# EAGLE design WeatherLightCoord (EAGLE 9.4.0)
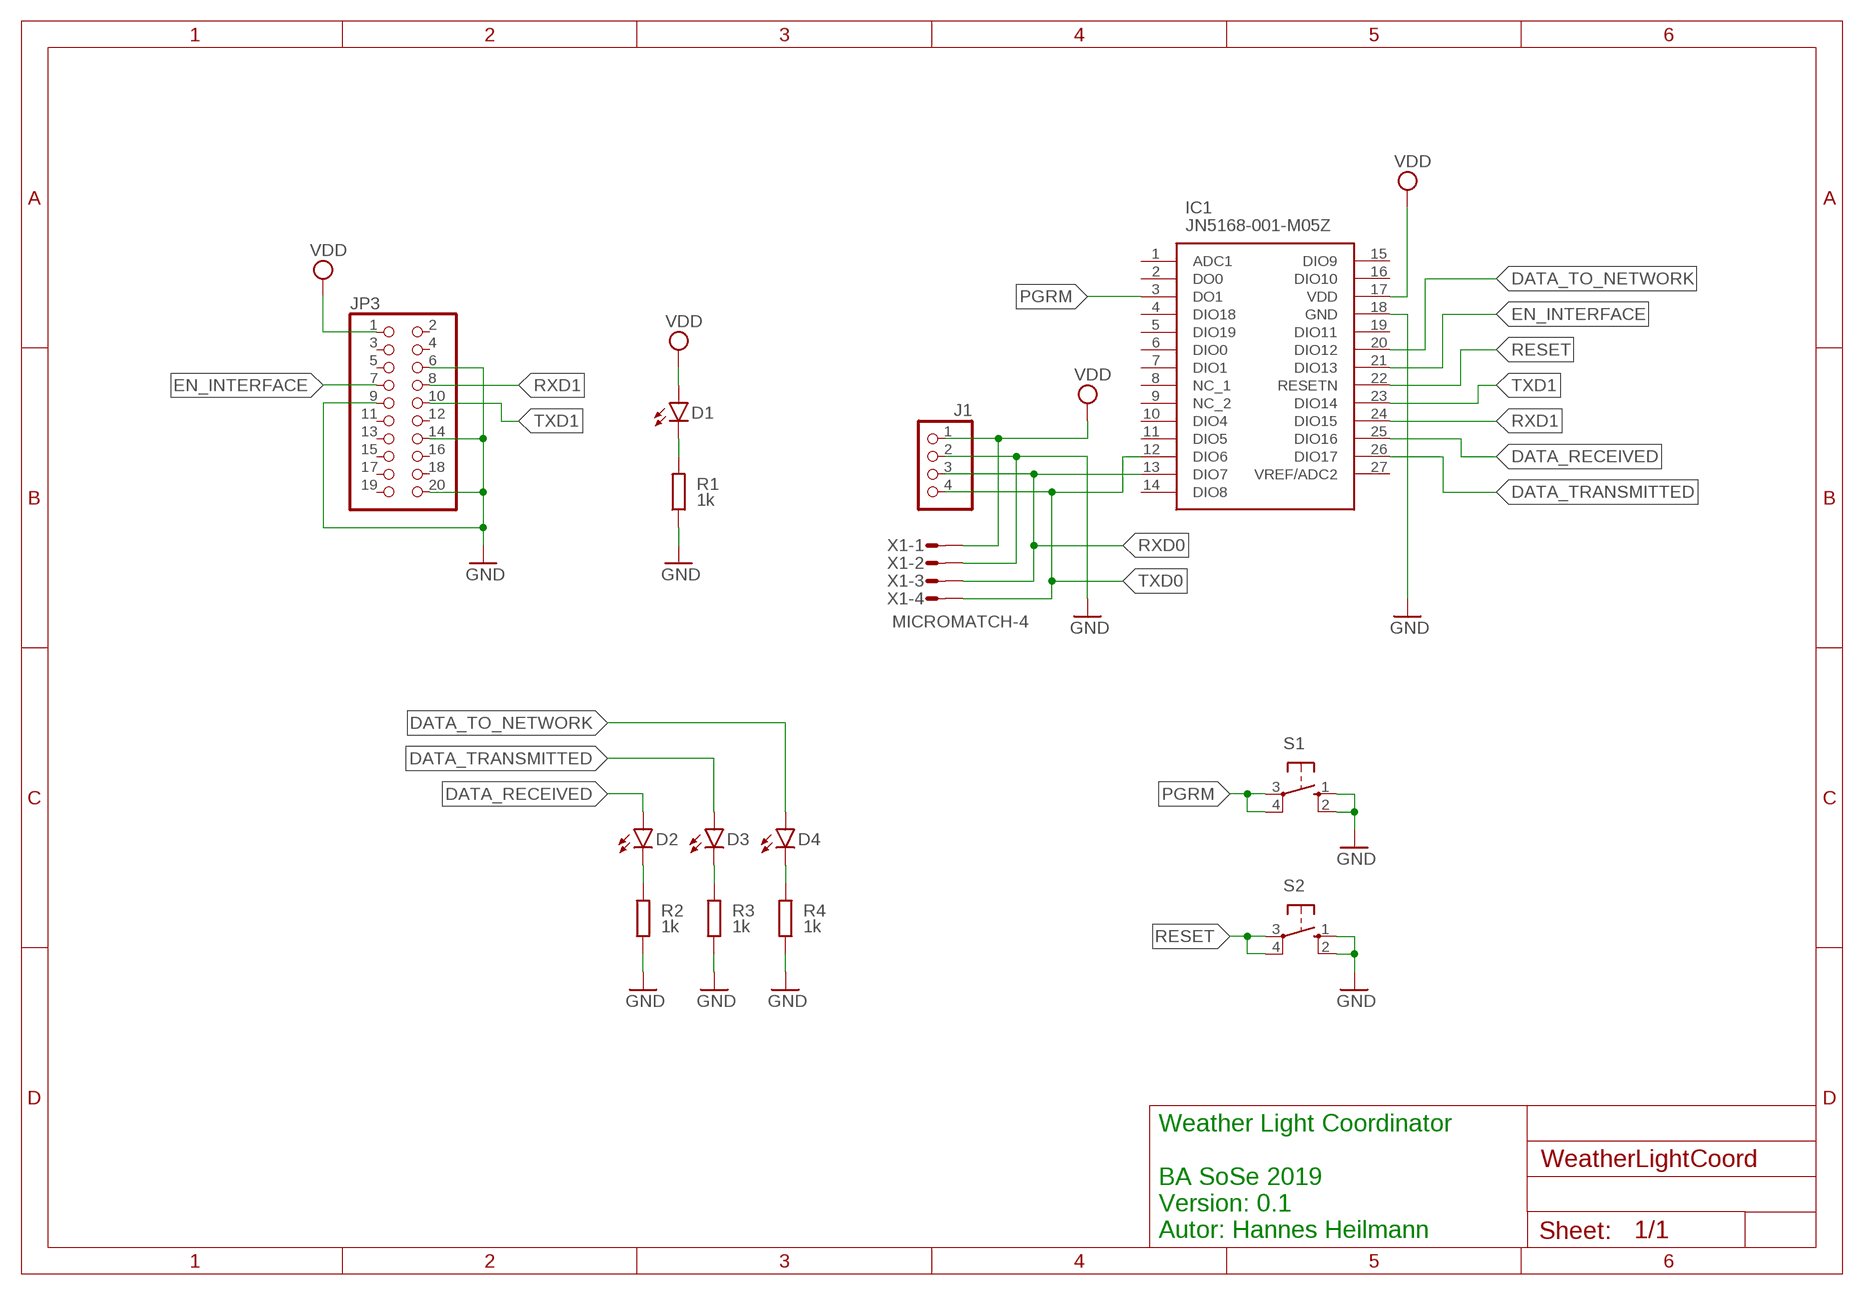
[diagram p0: schematic, sheet 1]

## Parts
D1  LEDCHIPLED_1206  [CHIPLED_1206]
D2  LEDCHIPLED_1206  [CHIPLED_1206]
D3  LEDCHIPLED_1206  [CHIPLED_1206]
D4  LEDCHIPLED_1206  [CHIPLED_1206]
IC1  JN5168-001-M05Z  [JN5168001M05Z]
J1  PINHD-1X4  [1X04]
JP3  PINHD-2X10  [2X10]
R1  1k  R-EU_R1206  [R1206]
R2  1k  R-EU_R1206  [R1206]
R3  1k  R-EU_R1206  [R1206]
R4  1k  R-EU_R1206  [R1206]
S1  10-XX  [B3F-10XX]
S2  10-XX  [B3F-10XX]
X1  MICROMATCH-4  [MICROMATCH-4]

## Nets
DATA_RECEIVED: D2.A IC1.25(DIO16)
DATA_TO_NETWORK: D4.A IC1.20(DIO12)
DATA_TRANSMITTED: D3.A IC1.26(DIO17)
EN_INTERFACE: IC1.21(DIO13) JP3.7
GND: IC1.18(GND) J1.2 JP3.6 JP3.9 JP3.14 JP3.20 R1.1 R2.1 R3.1 R4.1 S1.1(S) S1.2(S1) S2.1(S) S2.2(S1) X1.2
N$3: D1.C R1.2
N$4: D4.C R4.2
N$9: D3.C R3.2
N$10: D2.C R2.2
PGRM: IC1.3(DO1) S1.3(P) S1.4(P1)
RESET: IC1.22(RESETN) S2.3(P) S2.4(P1)
RXD0: IC1.13(DIO7) J1.3 X1.3
RXD1: IC1.24(DIO15) JP3.8
TXD0: IC1.12(DIO6) J1.4 X1.4
TXD1: IC1.23(DIO14) JP3.10
VDD: D1.A IC1.17(VDD) J1.1 JP3.1 X1.1
Unconnected: IC1.1(ADC1) IC1.2(DO0) IC1.4(DIO18) IC1.5(DIO19) IC1.6(DIO0) IC1.7(DIO1) IC1.8(NC_1) IC1.9(NC_2) IC1.10(DIO4) IC1.11(DIO5) IC1.14(DIO8) IC1.15(DIO9) IC1.16(DIO10) IC1.19(DIO11) IC1.27(VREF/ADC2) JP3.2 JP3.3 JP3.4 JP3.5 JP3.11 JP3.12 JP3.13 JP3.15 JP3.16 JP3.17 JP3.18 JP3.19

## Notes on the sheet
- Weather Light Coordinator
  
  BA SoSe 2019
  Version: 0.1
  Autor: Hannes Heilmann

## Library data of the parts
D1-D4 = led:LED: LED OSRAM: - CHIPLED LG R971, LG N971, LY N971, LG Q971, LY Q971, LO R971, LY R971 LH N974, LH R974 LS Q976, LO Q976, LY Q976 LO Q996 - Hyper CHIPLED LW Q18S LB Q993, LB Q99A, LB R99A - SideLED LS A670, LO A670, LY A670, LG A670, LP A670 LB A673, LV A673, LT A673, LW A673 LH A674 LY A675 LS A676, LA A676, LO A676, LY A676, LW A676 LS A679, LY A679, LG A679 - Hyper Micro SIDELED® LS Y876, LA Y876, LO Y876, LY Y876 LT Y87S - SmartLED LW L88C, LW L88S LB L89C, LB L89S, LG L890 LS L89K, LO L89K, LY L89K LS L896, LA L896, LO L896, LY L896 - TOPLED LS T670, LO T670, LY T670, LG T670, LP T670 LSG T670, LSP T670, LSY T670, LOP T670, LYG T670 LG T671, LOG T671, LSG T671 LB T673, LV T673, LT T673, LW T673 LH T674 LS T676, LA T676, LO T676, LY T676, LB T676, LH T676, LSB T676, LW T676 LB T67C, LV T67C, LT T67C, LS T67K, LO T67K, LY T67K, LW E67C LS E67B, LA E67B, LO E67B, LY E67B, LB E67C, LV E67C, LT E67C LW T67C LS T679, LY T679, LG T679 LS T770, LO T770, LY T770, LG T770, LP T770 LB T773, LV T773, LT T773, LW T773 LH T774 LS E675, LA E675, LY E675, LS T675 LS T776, LA T776, LO T776, LY T776, LB T776 LHGB T686 LT T68C, LB T68C - Hyper Mini TOPLED® LB M676 - Mini TOPLED Santana® LG M470 LS M47K, LO M47K, LY M47K Source: http://www.osram.convergy.de LUXEON: - LUMILED® LXK2-PW12-R00, LXK2-PW12-S00, LXK2-PW14-U00, LXK2-PW14-V00 LXK2-PM12-R00, LXK2-PM12-S00, LXK2-PM14-U00 LXK2-PE12-Q00, LXK2-PE12-R00, LXK2-PE12-S00, LXK2-PE14-T00, LXK2-PE14-U00 LXK2-PB12-K00, LXK2-PB12-L00, LXK2-PB12-M00, LXK2-PB14-N00, LXK2-PB14-P00, LXK2-PB14-Q00 LXK2-PR12-L00, LXK2-PR12-M00, LXK2-PR14-Q00, LXK2-PR14-R00 LXK2-PD12-Q00, LXK2-PD12-R00, LXK2-PD12-S00 LXK2-PH12-R00, LXK2-PH12-S00 LXK2-PL12-P00, LXK2-PL12-Q00, LXK2-PL12-R00 Source: www.luxeon.com KINGBRIGHT: KA-3528ASYC Source: www.kingbright.com
IC1 = SamacSys_Parts:JN5168-001-M05Z: NXP - JN5168-001-M05Z - RF MOD, IEEE802.15.4, MED PWR, UFL CONN Source: Datasheet <https://www.nxp.com/docs/en/data-sheet/JN5168-001-MXX.pdf>; DESCRIPTION: NXP - JN5168-001-M05Z - RF MOD, IEEE802.15.4, MED PWR, UFL CONN; HEIGHT: 5mm; MANUFACTURER_NAME: Nexperia; MANUFACTURER_PART_NUMBER: JN5168-001-M05Z; MOUSER_PART_NUMBER: 771-JN5168-001-M05Z; MOUSER_PRICE-STOCK: https://www.mouser.com/Search/Refine.aspx?Keyword=771-JN5168-001-M05Z
J1 = pinhead:PINHD-1X4: PIN HEADER
JP3 = pinhead:PINHD-2X10: PIN HEADER
R1-R4 = rcl:R-EU_: RESISTOR, European symbol; SPICEPREFIX: R
S1 S2 = switch-omron:10-XX: OMRON SWITCH; MPN: B3F-1000; OC_FARNELL: 176432; OC_NEWARK: 36M3542
X1 = con-amp-micromatch:MICROMATCH-4: MicroMaTch 4 7-215464-4 / 0-215464-4 Drawing Number C-215464 DDEController.pdf; MPN: 7-215464-4; OC_FARNELL: 3784629; OC_NEWARK: 19R8124

## Board
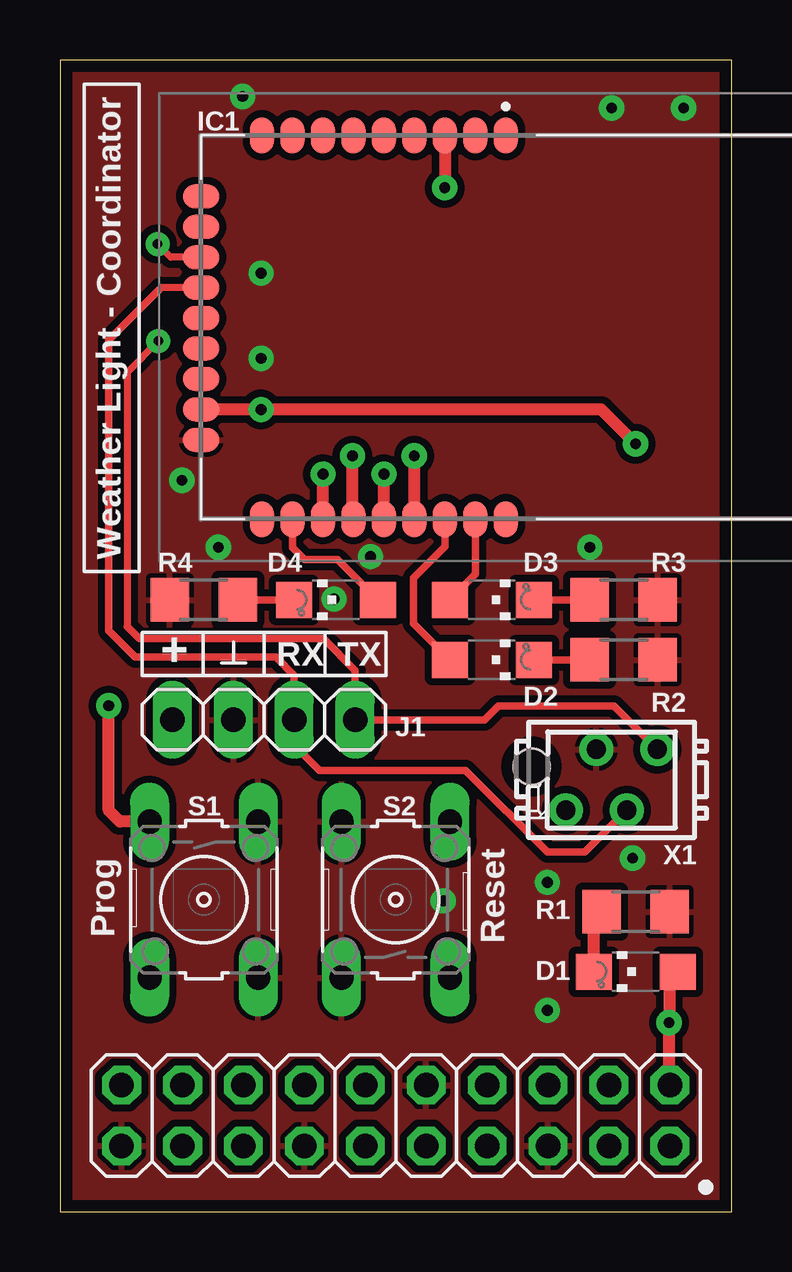
[diagram p1: board, top side]
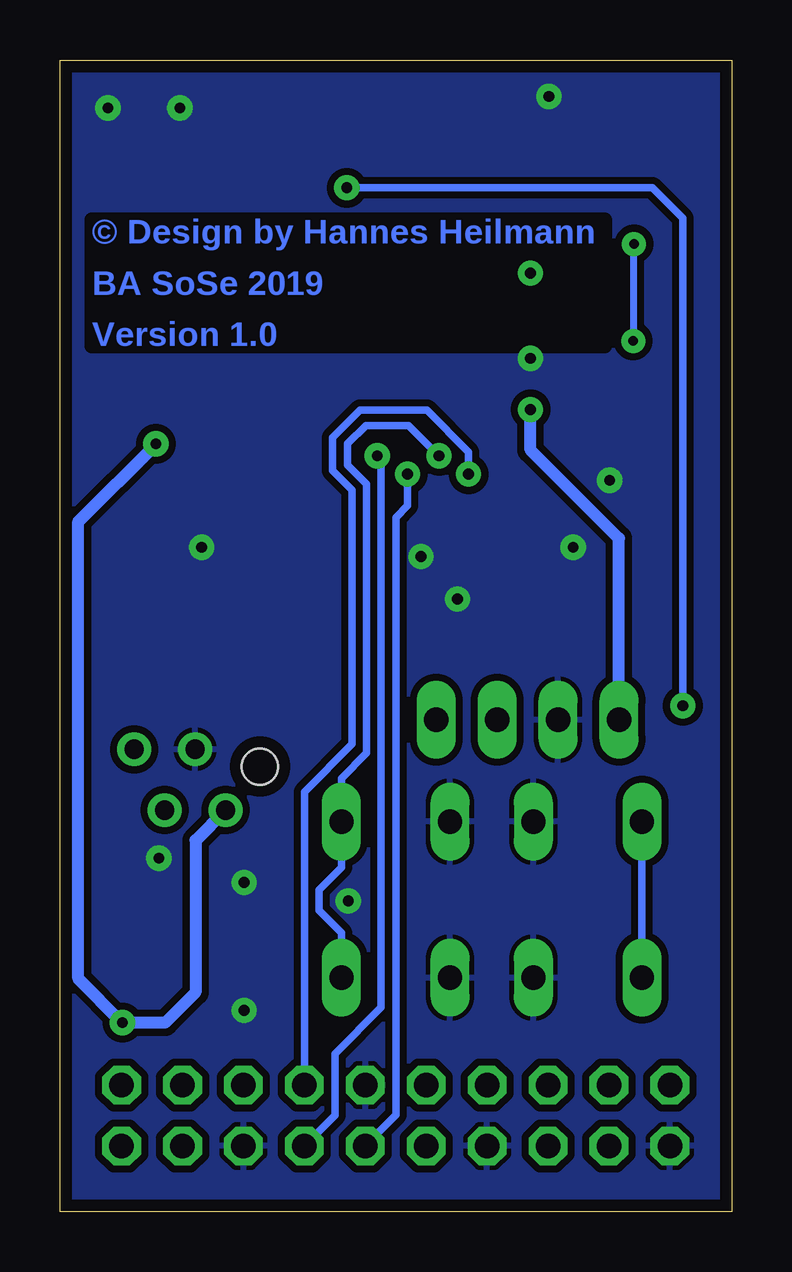
[diagram p2: board, bottom side, seen from below]

Size 28 x 48 mm. Coordinates in mm from the lower left corner, seen from the top.
Outline: 0,0 28,0 28,48 0,48 0,0
Copper layers (1*16): Top 0.035mm / dielectric 1.5mm / Bottom 0.035mm
Design rules "FVM_default": minimum track width 0.3mm, minimum drill 0.4mm, track to track 0.3mm, track to pad 0.3mm, pad to pad 0.3mm, via to via 0.3mm, smd to smd 0.15mm, copper to edge 0.5mm, drill to drill 0.2mm, minimum pad ring 0.3mm, minimum via ring 0.3mm, stop-mask expansion 0.075mm, vias tented up to drill 0mil, thermal gap 0.2mm

### Footprints (pad centres in the part's own frame; a part is rotated, then mirrored left to right if it is on the bottom)
CHIPLED_1206 = smd 1.5 x 1.5: A 0,-1.75; C 0,1.75
JN5168001M05Z = smd 1.5 x 1: 1 -8,-1.925; 2 -8,-3.195; 3 -8,-4.465; 4 -8,-5.735; 5 -8,-7.005; 6 -8,-8.275; 7 -8,-9.545; 8 -8,-10.815; 9 -8,-12.085; 19 8,-12.085; 20 8,-10.815; 21 8,-9.545; 22 8,-8.275; 23 8,-7.005; 24 8,-5.735; 25 8,-4.465; 26 8,-3.195; 27 8,-1.925 | smd 1 x 1.5: 10 -5.46,-14.625; 11 -4.19,-14.625; 12 -2.92,-14.625; 13 -1.65,-14.625; 14 -0.38,-14.625; 15 0.89,-14.625; 16 2.16,-14.625; 17 3.43,-14.625; 18 4.7,-14.625
1X04 = drill 1.016 long: 1 -3.81,0; 2 -1.27,0; 3 1.27,0; 4 3.81,0
2X10 = drill 1.016 octagon: 1 -11.43,-1.27; 2 -11.43,1.27; 3 -8.89,-1.27; 4 -8.89,1.27; 5 -6.35,-1.27; 6 -6.35,1.27; 7 -3.81,-1.27; 8 -3.81,1.27; 9 -1.27,-1.27; 10 -1.27,1.27; 11 1.27,-1.27; 12 1.27,1.27; 13 3.81,-1.27; 14 3.81,1.27; 15 6.35,-1.27; 16 6.35,1.27; 17 8.89,-1.27; 18 8.89,1.27; 19 11.43,-1.27; 20 11.43,1.27
R1206 = smd 1.6 x 1.803: 1 -1.422,0; 2 1.422,0
B3F-10XX = drill 1.016 long: 1 -3.251,2.261; 2 3.251,2.261; 3 -3.251,-2.261; 4 3.251,-2.261
MICROMATCH-4 = drill 0.8: 1 1.905,1.27; 2 0.635,-1.27; 3 -0.635,1.27; 4 -1.905,-1.27 | hole 1.5: 3.34,-0.55

### Placement (x,y rotation side)
D1  24,10 90 top
D2  18,23 270 top
D3  18,25.5 270 top
D4  11.5,25.5 90 top
IC1  20.51,36.86 270 top
J1  8.5,20.5 0 top
JP3  14,4 180 top
R1  24,12.5 180 top
R2  23.5,23 180 top
R3  23.5,25.5 180 top
R4  6,25.5 0 top
S1  6,13 270 top
S2  14,13 90 top
X1  23,18 180 top

### Tracks (layer width: path | path; a pad name or v marks a point on that pad's centre or on a via)
DATA_RECEIVED
  Top 0.305: D2.A 14.73,24.52 14.73,26.42 16.05,27.73 IC1.25
DATA_TO_NETWORK
  Top 0.305: IC1.20 9.7,27.69 10.2,27.18 11.57,27.18 D4.A
DATA_TRANSMITTED
  Top 0.305: D3.A 17.32,26.57 IC1.26
EN_INTERFACE  (via drill 0.45)
  Top 0.508: IC1.21 v10.96,30.73
  Bottom 0.305: v10.96,30.73 10.96,31.67 12.7,33.4 15.49,33.4 16.64,32.26 16.64,30.89 15.81,30.07 15.81,19.49 17.81,17.5 JP3.7
GND  (via drill 0.45)
  other vias: 15.98,12.95 26,46 23,46 7.62,46.48 5.08,30.48 6.6,27.69 22.1,27.69 11.43,25.53 20.32,13.72 20.32,8.38 23.88,14.73 12.95,27.3 8.38,35.56 8.38,39.12
  pour Top: 0.5,0.5 27.5,0.5 27.5,47.5 0.5,47.5
  pour Bottom: 0.5,0.5 27.5,0.5 27.5,47.5 0.5,47.5
N$3
  Top 0.508: D1.C 22.25,12.17 R1.2
N$4
  Top 0.305: R4.2 D4.C
N$9
  Top 0.305: D3.C R3.2
N$10
  Top 0.305: D2.C R2.2
PGRM  (via drill 0.45)
  Top 0.508: IC1.3 v16.05,42.67 | S1.3 2.49,16.25 2.03,16.71 v2.03,21.08
  Bottom 0.305: S1.4 S1.3 | v2.03,21.08 2.03,41.4 3.3,42.67 v16.05,42.67
RESET  (via drill 0.45)
  Top 0.508: IC1.22 12.19,28.9 v12.19,31.5
  Bottom 0.305: v12.19,31.5 13.46,32.77 15.24,32.77 16,32 16,31.11 15.21,30.32 15.21,19.11 16.26,18.05 S2.4 16.26,14.35 17.2,13.4 17.2,12.56 16.26,11.61 S2.3
RXD0
  Top 0.3: IC1.13 4.22,38.51
  Top 0.305: 4.22,38.51 2.03,36.32 2.03,24.21 3.13,23.11 9.01,23.11 9.77,22.35 J1.3 9.77,19.44 10.82,18.39 16.92,18.39 20.32,14.99 21.89,14.99 X1.3
RXD1  (via drill 0.45)
  Top 0.508: IC1.24 v14.78,31.5
  Bottom 0.305: JP3.8 16.54,4 16.54,6.58 14.61,8.51 14.61,31.33 v14.78,31.5
TXD0  (via drill 0.4)
  Top 0.3: 2.79,24.38 2.79,34.98 v4.1,36.28 | IC1.12 4.62,39.78 v4.06,40.33
  Top 0.305: 2.79,24.38 3.3,23.88 10.99,23.88 12.31,22.56 J1.4 17.71,20.5 18.29,21.08 23.09,21.08 X1.4
  Bottom 0.3: v4.06,40.33 4.1,40.29 v4.1,36.28
TXD1  (via drill 0.45)
  Top 0.508: IC1.23 v13.51,30.73
  Bottom 0.305: JP3.10 15.27,2.75 13.99,4.03 13.99,28.93 13.51,29.42 v13.51,30.73
VDD  (via drill 0.45)
  Top 0.508: JP3.1 25.4,5.3 v25.4,7.87 25.4,9.65 D1.A | v24,32 22.57,33.43 v8.38,33.43 IC1.17
  Bottom 0.508: v24,32 27.24,28.76 27.24,9.71 v25.4,7.87 23.62,7.87 22.35,9.14 22.35,15.47 X1.1 | J1.1 4.69,28.06 8.38,31.75 v8.38,33.43

### Text on the board
Bottom: © Design by Hannes Heilmann / BA SoSe 2019 / Version 1.0
tNames: Weather Light - Coordinator | + | RX | TX | Prog | Reset